# Altium schematic sheet UART_RS485.SchDoc: Bluetooth Gateway
size A; CheckedBy: QUOCTHANG; DrawnBy: DONGKHOA; Revision: V1.0.0; SheetNumber: 8; SheetTotal: 10
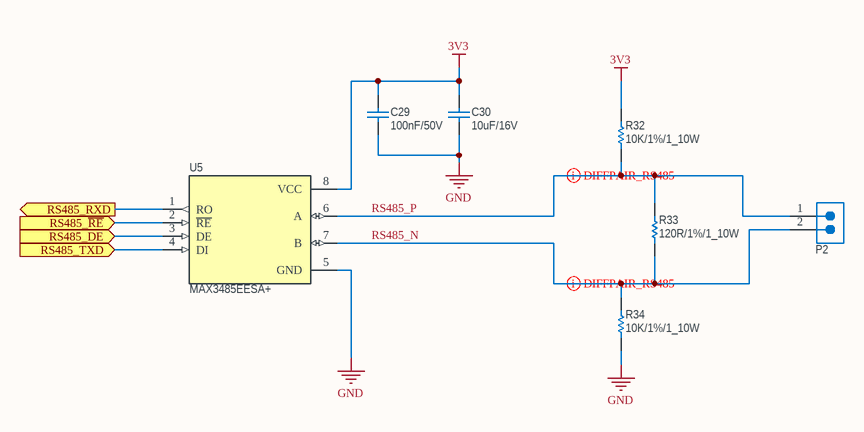
[diagram p0: UART_RS485.SchDoc]

## Parts
C29  100nF/50V  [CAP_0603]
C30  10uF/16V  [CAP_0603]
P2  3.81mm_2P  [Terminal_Block_3.81mm_2P]  (value not drawn)
R32  10K/1%/1_10W  [Resistor_0603]
R33  120R/1%/1_10W  [Resistor_0603]
R34  10K/1%/1_10W  [Resistor_0603]
U5  MAX3485EESA+  [SOIC-8]

## Ports
RS485_DE (in, see Overview_Schematic[5C], MCU[3B]), RS485_RXD (out, see Overview_Schematic[5C], MCU[3B]), RS485_TXD (in, see Overview_Schematic[5C], MCU[3B]), RS485_~{RE} (in, see Overview_Schematic[5C], MCU[3B])

## Nets
3V3: C29.2 C30.2 R32.2 U5.8(VCC)
GND: C29.1 C30.1 R34.2 U5.5(GND)
RS485_DE: U5.3(DE) ; port RS485_DE
RS485_N: P2.2 R33.1 R34.1 U5.7(B)
RS485_P: P2.1 R32.1 R33.2 U5.6(A)
RS485_~{RE}: U5.2(~{RE}) ; port RS485_~{RE}
RS485_RXD: U5.1(RO) ; port RS485_RXD
RS485_TXD: U5.4(DI) ; port RS485_TXD

## Layout directives
differential pair: RS485_N, RS485_P

## Notes on the sheet
- Project Name
- Size
- A4
- Revision
- Checked By:
- Drawn By:
- Date:
- File:
- Last Modified:
- Sheet
- of

## Library data of the parts
C29 = Ceramic_Cap_100nF_50V_0603: CAP, size 0603, 100nF, 50V; Supply Part Number: Tụ Gốm 0603 100nF (0.1uF) 50V; Supply Name: Thegioiic; Datasheet: *; Supply URL: https://www.thegioiic.com/tu-gom-0603-100nf-0-1uf-50v
C30 = Ceramic_Cap_10uF_16V_0603: CAP, size 0603, 10uF, 16V; Supply Part Number: Tụ Gốm 0603 10uF 16V; Supply Name: Thegioiic; Datasheet: *; Supply URL: https://www.thegioiic.com/tu-gom-0603-10uf-16v
P2 = Terminal_Block_3.81mm_2P: Terminal Block THT, pitch 3.81mm, 2p, 300V, 10A; Supply Part Number: UL-3.81-2-R Terminal Block Plug-in Hàn PCB 2 Chân Cong 3.81mm 300V 10A ULO; Supply Name: Thegioiic; Supply URL: https://www.thegioiic.com/ul-3-81-2-r-terminal-block-plug-in-han-pcb-2-chan-cong-3-81mm-300v-10a-ulo
R32 R34 = Res_10K_0603_1%: Resistor 0603 10KOhm 1% 1_10W; Supply Part Number: Điện Trở 10 KOhm 0603 1%; Supply Name: Thegioiic; Supply URL: https://www.thegioiic.com/dien-tro-10-kohm-0603-1-
R33 = Res_120R_0603_1%: Resistor 0603 120 Ohm 1% 1_10W; Supply Part Number: Điện Trở 120 Ohm 0603 1%; Supply Name: Thegioiic; Supply URL: https://www.thegioiic.com/dien-tro-120-ohm-0603-1-
U5 = MAX3485EESA+: 1/1 Transceiver Half RS422, RS485 8-SOIC; Supply Part Number: MAX3485EESA+ Line Transceiver, 8-SOIC; Supply Name: Thegioiic; Datasheet: https://www.analog.com/media/en/technical-documentation/data-sheets/max3483e-max3491e.pdf; Supply URL: https://www.thegioiic.com/max3485eesa-line-transceiver-8-soic